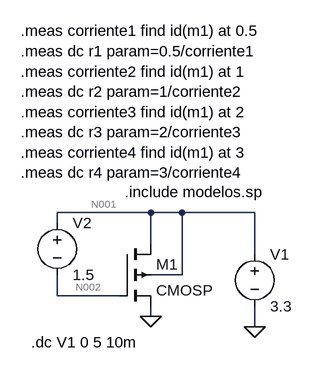
[diagram p0: schematic sim1 ID pmos.asc]
sim1 ID pmos.asc, the LTspice schematic file:
Version 4
SHEET 1 880 680
WIRE 192 48 48 48
WIRE 240 48 192 48
WIRE 352 48 240 48
WIRE 48 64 48 48
WIRE 192 96 192 48
WIRE 352 112 352 48
WIRE 240 144 240 48
WIRE 240 144 192 144
WIRE 48 176 48 144
WIRE 144 176 48 176
WIRE 192 208 192 192
WIRE 352 224 352 192
FLAG 352 224 0
FLAG 192 208 0
SYMBOL pmos4 144 96 R0
SYMATTR InstName M1
SYMATTR Value CMOSP
SYMATTR Value2 l=0.6u w=6u
SYMBOL voltage 352 96 R0
WINDOW 123 0 0 Left 0
WINDOW 39 0 0 Left 0
SYMATTR InstName V1
SYMATTR Value 3.3
SYMBOL voltage 48 48 R0
WINDOW 123 0 0 Left 0
WINDOW 39 0 0 Left 0
SYMATTR InstName V2
SYMATTR Value 1.5
TEXT 152 16 Left 2 !.include modelos.sp
TEXT 8 248 Left 2 !.dc V1 0 5 10m
TEXT -8 -232 Left 2 !.meas corriente1 find id(m1) at 0.5\n.meas dc r1 param=0.5/corriente1\n.meas corriente2 find id(m1) at 1\n.meas dc r2 param=1/corriente2\n.meas corriente3 find id(m1) at 2\n.meas dc r3 param=2/corriente3\n.meas corriente4 find id(m1) at 3\n.meas dc r4 param=3/corriente4

The netlist it stands for:
* sim1 ID pmos.asc
M1 N001 N002 0 N001 CMOSP l=0.6u w=6u
V1 N001 0 3.3
V2 N001 N002 1.5
.model NMOS NMOS
.model PMOS PMOS
.lib standard.mos
.include modelos.sp
.dc V1 0 5 10m
.meas corriente1 find id(m1) at 0.5
.meas dc r1 param=0.5/corriente1
.meas corriente2 find id(m1) at 1
.meas dc r2 param=1/corriente2
.meas corriente3 find id(m1) at 2
.meas dc r3 param=2/corriente3
.meas corriente4 find id(m1) at 3
.meas dc r4 param=3/corriente4
.backanno
.end

* Results of the author's LTspice run, read from the files saved beside the schematic
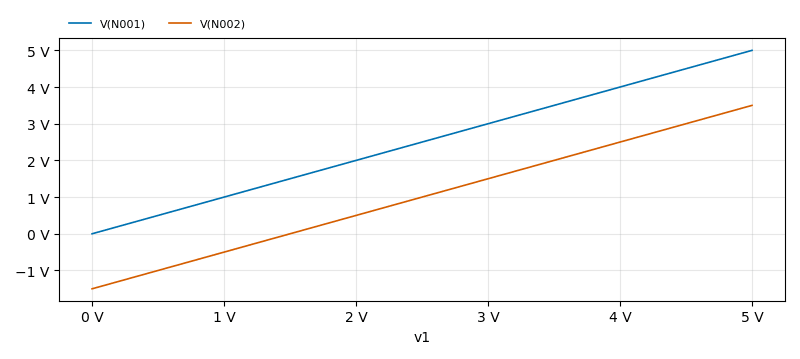
[diagram p1: DC transfer characteristic of sim1 ID pmos.asc, plotted from the saved traces]
* DC transfer characteristic, 1 run:
*   V(N001): 0 V at v1=0 V, 5 V at v1=5 V, min 0 V, max 5 V
*   V(N002): -1.5 V at v1=0 V, 3.5 V at v1=5 V, min -1.5 V, max 3.5 V
* From the log:
*   corriente1: id(m1)=6.6182e-05 at 0.5
*   r1: 0.5/corriente1=7554.92
*   corriente2: id(m1)=7.8276e-05 at 1
*   r2: 1/corriente2=12775.3
*   corriente3: id(m1)=9.09263e-05 at 2
*   r3: 2/corriente3=21995.8
*   corriente4: id(m1)=0.000100186 at 3
*   r4: 3/corriente4=29944.2